# Altium schematic sheet 1_classyTKL_EC_top.SchDoc: ClassyTKL - MX
size A4; Engineer: 4pplet; Address1: github.com/4pplet/classytkl; Address2: Licence: CERN-OHL-S; Revision: A3; SheetNumber: 1; SheetTotal: 3; ProjectName: waffling60
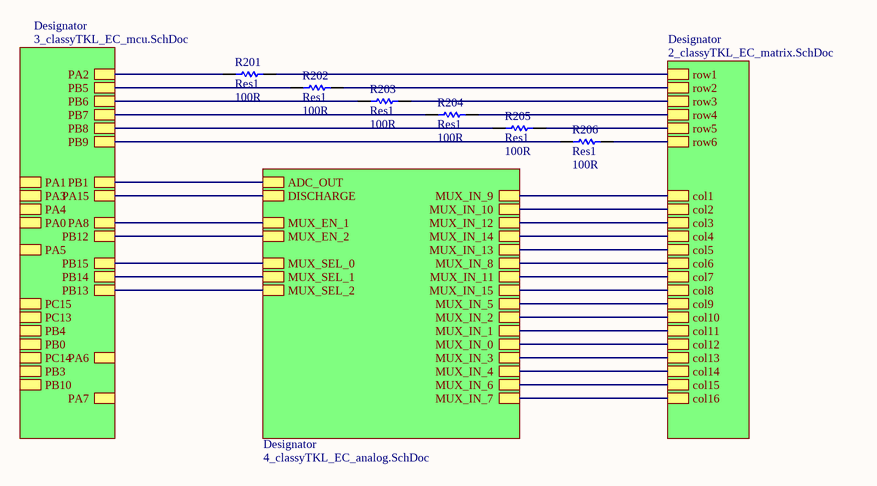
[diagram p0: 1_classyTKL_EC_top.SchDoc]

## Parts
R201  Res1  value 100R  [R0603[1608]]
R202  Res1  value 100R  [R0603[1608]]
R203  Res1  value 100R  [R0603[1608]]
R204  Res1  value 100R  [R0603[1608]]
R205  Res1  value 100R  [R0603[1608]]
R206  Res1  value 100R  [R0603[1608]]

## Sub-sheets
Designator = 3_classyTKL_EC_mcu.SchDoc: PB4, PB0, PA0, PA1, PA2, PA3, PA4, PA5, PA15, PB1, PB3, PB5, PB8, PB9, PB10, PB12, PB14, PC13, PC14, PC15, PA8, PA6, PA7, PB6, PB7, PB13, PB15
Designator = 2_classyTKL_EC_matrix.SchDoc: col6, col8, col5, col7, col3, col2, col1, col4, col9, row3, row1, row4, row2, row6, row5, col10, col11, col14, col15, col13, col12, col16
Designator = 4_classyTKL_EC_analog.SchDoc: ADC_OUT, DISCHARGE, MUX_EN_1, MUX_EN_2, MUX_SEL_0, MUX_SEL_1, MUX_SEL_2, MUX_IN_0, MUX_IN_8, MUX_IN_9, MUX_IN_10, MUX_IN_11, MUX_IN_12, MUX_IN_13, MUX_IN_14, MUX_IN_15, MUX_IN_1, MUX_IN_2, MUX_IN_3, MUX_IN_4, MUX_IN_5, MUX_IN_6, MUX_IN_7

## Nets
NetR201_1: R201.1 ; sheet Designator/PA2
NetR201_2: R201.2 ; sheet Designator/row1
NetR202_1: R202.1 ; sheet Designator/PB5
NetR202_2: R202.2 ; sheet Designator/row2
NetR203_1: R203.1 ; sheet Designator/PB6
NetR203_2: R203.2 ; sheet Designator/row3
NetR204_1: R204.1 ; sheet Designator/PB7
NetR204_2: R204.2 ; sheet Designator/row4
NetR205_1: R205.1 ; sheet Designator/PB8
NetR205_2: R205.2 ; sheet Designator/row5
NetR206_1: R206.1 ; sheet Designator/PB9
NetR206_2: R206.2 ; sheet Designator/row6
(unnamed): sheet Designator/PA15, sheet Designator/DISCHARGE
(unnamed): sheet Designator/PB1, sheet Designator/ADC_OUT
(unnamed): sheet Designator/PB12, sheet Designator/MUX_EN_2
(unnamed): sheet Designator/PB14, sheet Designator/MUX_SEL_1
(unnamed): sheet Designator/PA8, sheet Designator/MUX_EN_1
(unnamed): sheet Designator/PB13, sheet Designator/MUX_SEL_2
(unnamed): sheet Designator/PB15, sheet Designator/MUX_SEL_0
(unnamed): sheet Designator/col6, sheet Designator/MUX_IN_8
(unnamed): sheet Designator/col8, sheet Designator/MUX_IN_15
(unnamed): sheet Designator/col5, sheet Designator/MUX_IN_13
(unnamed): sheet Designator/col7, sheet Designator/MUX_IN_11
(unnamed): sheet Designator/col3, sheet Designator/MUX_IN_12
(unnamed): sheet Designator/col2, sheet Designator/MUX_IN_10
(unnamed): sheet Designator/col1, sheet Designator/MUX_IN_9
(unnamed): sheet Designator/col4, sheet Designator/MUX_IN_14
(unnamed): sheet Designator/col9, sheet Designator/MUX_IN_5
(unnamed): sheet Designator/col10, sheet Designator/MUX_IN_2
(unnamed): sheet Designator/col11, sheet Designator/MUX_IN_1
(unnamed): sheet Designator/col14, sheet Designator/MUX_IN_4
(unnamed): sheet Designator/col15, sheet Designator/MUX_IN_6
(unnamed): sheet Designator/col13, sheet Designator/MUX_IN_3
(unnamed): sheet Designator/col12, sheet Designator/MUX_IN_0
(unnamed): sheet Designator/col16, sheet Designator/MUX_IN_7

## Notes on the sheet
- Title
- Size:
- Date:
- A4
- Number:
- Time:
- Revision:
- Sheet
- of
- File:

## Library data of the parts
R201-R206 = Res1: Resistor; MRF.Part: 0603WAF1003T5E; LCSC MFG: Uniroyal Elec; Version: 0603 imperial; LCSC Part #: C25803